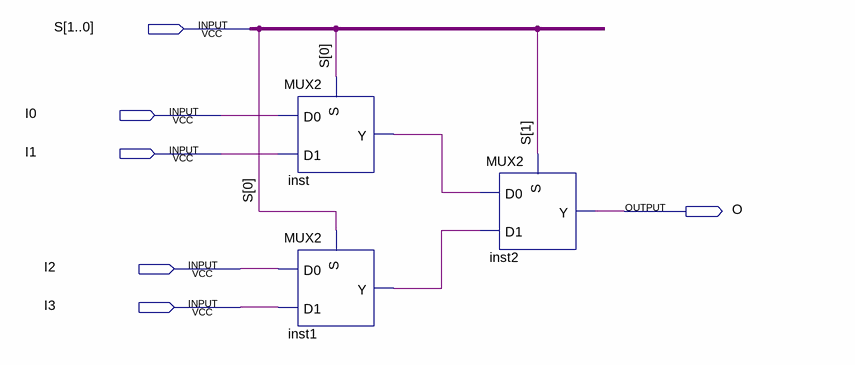
[diagram p0: schematic sheet]
// Quartus schematic mux4_1bit.bdf as structural Verilog: 3 symbols, 6 pins
module mux4_1bit (
  input  [1:0] S,
  input  I0,
  input  I1,
  input  I2,
  input  I3,
  output O
);

  wire inst1_y, inst_y;

  MUX2 inst (.S(S[0]), .D1(I1), .D0(I0), .Y(inst_y));
  MUX2 inst1 (.S(S[0]), .D1(I3), .D0(I2), .Y(inst1_y));
  MUX2 inst2 (.S(S[1]), .D1(inst1_y), .D0(inst_y), .Y(O));
endmodule
